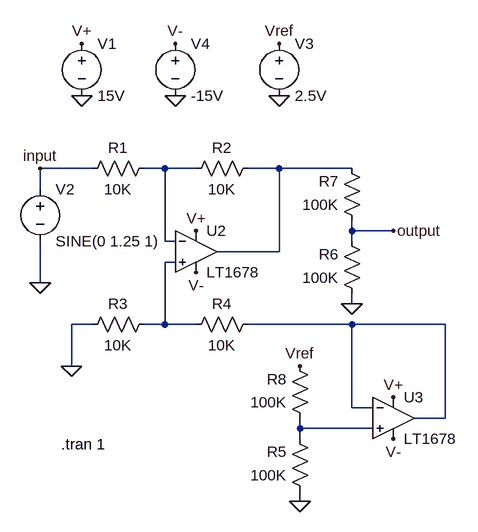
[diagram p0: schematic Level_shift.asc]
Level_shift.asc, the LTspice schematic file:
Version 4
SHEET 1 2216 948
WIRE 528 48 448 48
WIRE 640 48 608 48
WIRE 688 48 640 48
WIRE 816 48 768 48
WIRE 928 48 816 48
WIRE 448 80 448 48
WIRE 928 144 928 128
WIRE 992 144 928 144
WIRE 640 160 640 48
WIRE 656 160 640 160
WIRE 928 160 928 144
WIRE 816 176 816 48
WIRE 816 176 720 176
WIRE 656 192 640 192
WIRE 448 224 448 160
WIRE 928 256 928 240
WIRE 528 288 496 288
WIRE 640 288 640 192
WIRE 640 288 608 288
WIRE 688 288 640 288
WIRE 928 288 768 288
WIRE 1072 288 928 288
WIRE 496 352 496 288
WIRE 928 416 928 288
WIRE 960 416 928 416
WIRE 1072 432 1072 288
WIRE 1072 432 1024 432
WIRE 848 448 848 432
WIRE 960 448 848 448
WIRE 848 464 848 448
WIRE 848 560 848 544
FLAG 512 -64 0
FLAG 512 -144 V+
FLAG 656 -64 0
FLAG 656 -144 V-
FLAG 816 -64 0
FLAG 816 -144 Vref
FLAG 448 224 0
FLAG 496 352 0
FLAG 848 352 Vref
FLAG 848 560 0
FLAG 448 48 input
FLAG 688 144 V+
FLAG 688 208 V-
FLAG 992 464 V-
FLAG 992 400 V+
FLAG 992 144 output
FLAG 928 256 0
SYMBOL voltage 512 -160 R0
WINDOW 123 0 0 Left 2
WINDOW 39 0 0 Left 2
SYMATTR InstName V1
SYMATTR Value 15V
SYMBOL voltage 448 64 R0
WINDOW 123 0 0 Left 2
WINDOW 39 0 0 Left 2
SYMATTR InstName V2
SYMATTR Value SINE(0 1.25 1)
SYMBOL voltage 656 -160 R0
WINDOW 123 0 0 Left 2
WINDOW 39 0 0 Left 2
SYMATTR InstName V4
SYMATTR Value -15V
SYMBOL Opamps\\LT1678 688 176 R0
SYMATTR InstName U2
SYMBOL voltage 816 -160 R0
WINDOW 123 0 0 Left 2
WINDOW 39 0 0 Left 2
SYMATTR InstName V3
SYMATTR Value 2.5V
SYMBOL res 624 272 R90
WINDOW 0 0 56 VBottom 2
WINDOW 3 32 56 VTop 2
SYMATTR InstName R3
SYMATTR Value 10K
SYMBOL res 784 272 R90
WINDOW 0 0 56 VBottom 2
WINDOW 3 32 56 VTop 2
SYMATTR InstName R4
SYMATTR Value 10K
SYMBOL res 624 32 R90
WINDOW 0 0 56 VBottom 2
WINDOW 3 32 56 VTop 2
SYMATTR InstName R1
SYMATTR Value 10K
SYMBOL res 784 32 R90
WINDOW 0 0 56 VBottom 2
WINDOW 3 32 56 VTop 2
SYMATTR InstName R2
SYMATTR Value 10K
SYMBOL Opamps\\LT1678 992 432 R0
SYMATTR InstName U3
SYMBOL res 864 560 R180
WINDOW 0 36 76 Left 2
WINDOW 3 36 40 Left 2
SYMATTR InstName R5
SYMATTR Value 100K
SYMBOL res 864 448 R180
WINDOW 0 36 76 Left 2
WINDOW 3 36 40 Left 2
SYMATTR InstName R8
SYMATTR Value 100K
SYMBOL res 944 256 R180
WINDOW 0 36 76 Left 2
WINDOW 3 36 40 Left 2
SYMATTR InstName R6
SYMATTR Value 100K
SYMBOL res 944 144 R180
WINDOW 0 36 76 Left 2
WINDOW 3 36 40 Left 2
SYMATTR InstName R7
SYMATTR Value 100K
TEXT 480 472 Left 2 !.tran 1

The netlist it stands for:
* Level_shift.asc
V1 V+ 0 15V
V2 input 0 SINE(0 1.25 1)
V4 V- 0 -15V
XU2 N003 N001 N002 V+ V- LT1678  ; pins In+ In- OUT V+ V-
V3 Vref 0 2.5V
R3 N003 0 10K
R4 N004 N003 10K
R1 N001 input 10K
R2 N002 N001 10K
XU3 N005 N004 N004 V+ V- LT1678  ; pins In+ In- OUT V+ V-
R5 0 N005 100K
R8 N005 Vref 100K
R6 0 output 100K
R7 output N002 100K
.tran 1
.backanno
.end